# EAGLE design MotorBackplate (EAGLE 8.3.1)
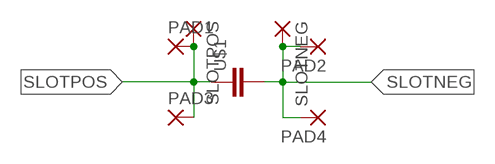
[diagram p0: schematic, sheet 1]

## Parts
PAD1  PADNRML  [PAD_NRML]
PAD2  PADNRML  [PAD_NRML]
PAD3  PADLG  [PAD_LG]
PAD4  PADLG  [PAD_LG]
SLOTNEG  PAD  [SLOTPAD]
SLOTPOS  PAD  [SLOTPAD]
U$1  CAP_SMNORM  [CAP_SM]

## Nets
SLOTNEG: PAD2.P$2(P) PAD4.P$2(P) SLOTNEG.+(P) U$1.2
SLOTPOS: PAD1.P$2(P) PAD3.P$2(P) SLOTPOS.+(P) U$1.1

## Library data of the parts
PAD1-PAD4 SLOTNEG SLOTPOS = Richard_Components:PAD: THROUGH-HOLE PAD
U$1 = Richard_Components:CAP_SM

## Net classes
0 default: width 0.508 mm

## Board
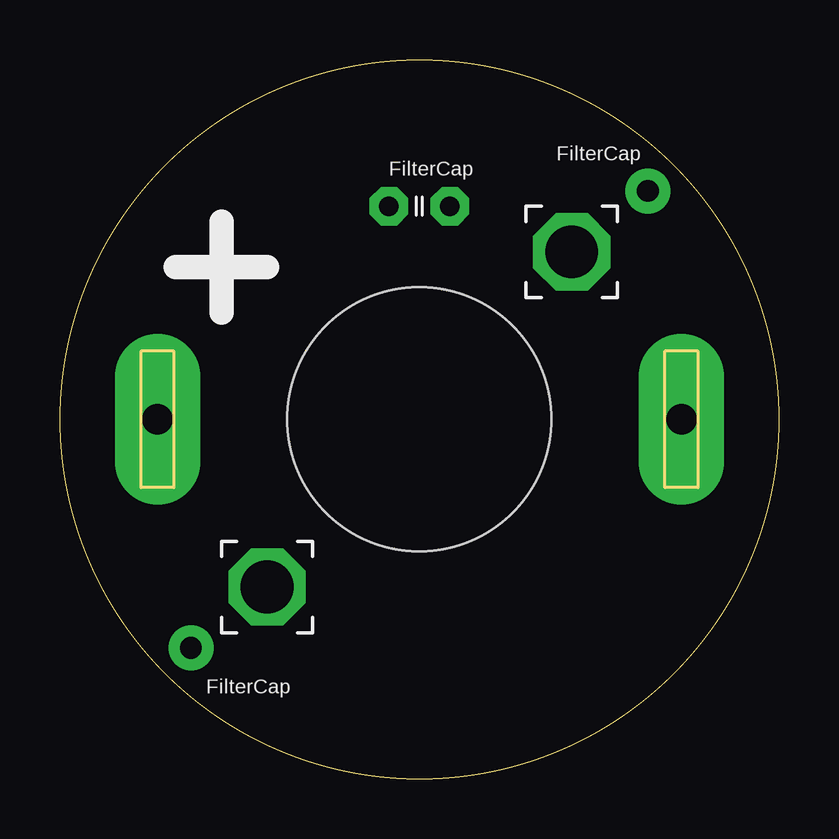
[diagram p1: board, top side]
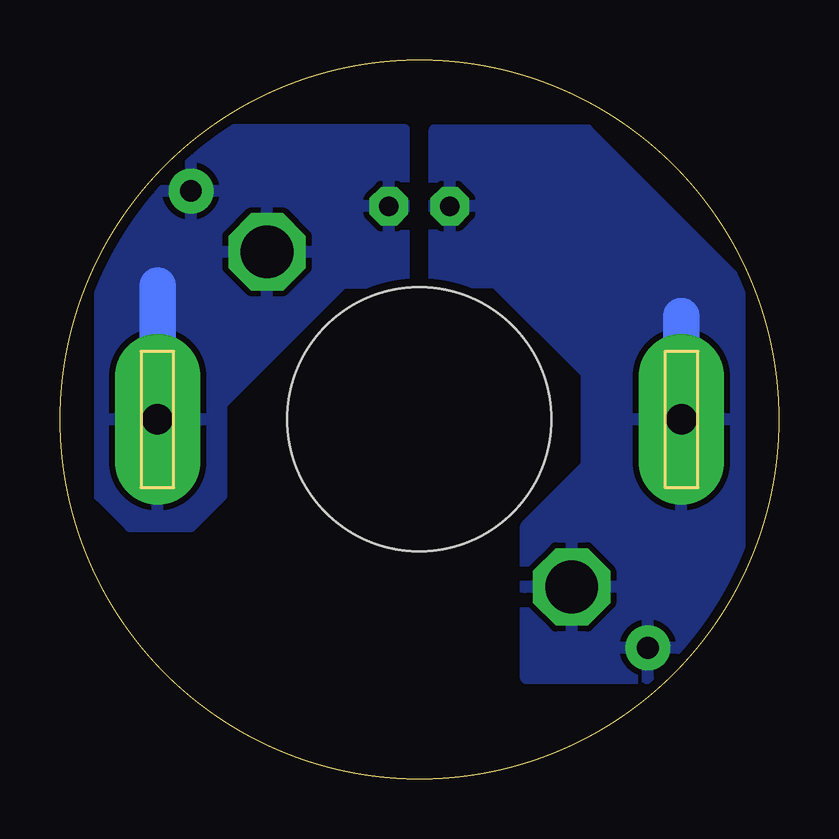
[diagram p2: board, bottom side, seen from below]

Size 29.97 x 29.97 mm. Coordinates in mm from the lower left corner, seen from the top.
Outline: circle at 14.99,14.99 radius 14.99
Copper layers (1*16): Top 0.0356mm / dielectric 1.5011mm / Bottom 0.0356mm
Design rules "LaenPCBOrder": minimum track width 6mil, minimum drill 13mil, track to track 6mil, track to pad 6mil, pad to pad 6mil, via to via 6mil, smd to smd 6mil, copper to edge 15mil, drill to drill 6mil, minimum pad ring 7mil, minimum via ring 7mil, stop-mask expansion 3mil, vias tented up to drill 0mil, thermal gap 10mil
Holes 11 mm at 14.99,14.99

### Footprints (pad centres in the part's own frame; a part is rotated, then mirrored left to right if it is on the bottom)
PAD_NRML = drill 0.9 pad 1.88: P$2 0,0
PAD_LG = drill 2.2 octagon: P$2 0,0
SLOTPAD = drill 1.27 pad 3.556 long: + 0,0
CAP_SM = drill 0.813 pad 1.6 octagon: 1 -1.27,0; 2 1.27,0

### Placement (x,y rotation side)
PAD1  5.46,5.46 0 top
PAD2  24.51,24.51 0 top
PAD3  8.64,8 0 top
PAD4  21.34,21.97 0 top
SLOTNEG  25.91,14.99 90 top
SLOTPOS  4.06,14.99 90 top
U$1  14.99,23.88 0 top

### Tracks (layer width: path | path; a pad name or v marks a point on that pad's centre or on a via)
SLOTNEG
  Bottom 0.508: 25.91,20.57 25.78,20.7
  Bottom 1.524: SLOTNEG.+ 25.91,20.57
  pour Bottom: 15.62,20.7 15.62,27.05 23.24,27.05 28.32,21.97 28.32,11.81 27.05,10.54 24.51,10.54 23.24,11.81 23.24,15.62 18.16,20.7
SLOTPOS
  Bottom 0.508: 4.06,19.3 4.19,19.43
  Bottom 1.524: SLOTPOS.+ 4.06,19.3
  pour Bottom: 14.35,20.7 14.35,27.05 8,27.05 1.65,20.7 1.65,8 5.46,4.19 10.54,4.19 10.54,10.54 8,13.08 8,16.89 11.81,20.7

### Text on the board
tPlace: FilterCap | FilterCap | FilterCap